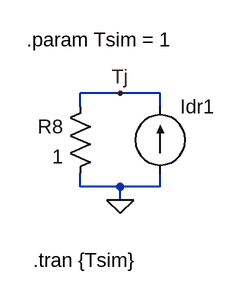
[diagram p0: schematic thermal_test_file.asc]
* thermal_test_file.asc
R8 Tj 0 1
Idr1 0 Tj PWL(0               0        0.000999               0           0.001           20000   0.00100693863           20000   0.00101392541           20000   0.00102096066           20000   0.00102804473           20000   0.00103517796           20000   0.00104236067           20000   0.00104959323           20000   0.00105687597               0   0.00106420924               0    0.0010715934               0   0.00107902879               0   0.00108651577               0   0.00109405471               0   0.00110164595               0   0.00110928986      18029.5526   0.00111698682      18029.5526   0.00112473718      18029.5526   0.00113254132      18029.5526    0.0011403996      18029.5526   0.00114831241      18029.5526   0.00115628013      18029.5526   0.00116430313      18029.5526    0.0011723818               0   0.00118051653               0    0.0011887077               0    0.0011969557               0   0.00120526094               0    0.0012136238               0   0.00122204469               0     0.001230524      16253.2384   0.00123906216      16253.2384   0.00124765955      16253.2384    0.0012563166      16253.2384   0.00126503372      16253.2384   0.00127381132      16253.2384   0.00128264983      16253.2384   0.00129154967      16253.2384   0.00130051125               0   0.00130953502               0    0.0013186214               0   0.00132777083               0   0.00133698374               0   0.00134626058               0   0.00135560179               0   0.00136500781      14651.9309   0.00137447909      14651.9309    0.0013840161      14651.9309   0.00139361927      14651.9309   0.00140328908      14651.9309   0.00141302599      14651.9309   0.00142283046      14651.9309   0.00143270295      14651.9309   0.00144264395               0   0.00145265393               0   0.00146273336               0   0.00147288272               0   0.00148310251               0   0.00149339322               0   0.00150375532               0   0.00151418933      13208.3879   0.00152469573      13208.3879   0.00153527503      13208.3879   0.00154592774      13208.3879   0.00155665436      13208.3879   0.00156745541      13208.3879   0.00157833141      13208.3879   0.00158928287      13208.3879   0.00160031031               0   0.00161141428               0   0.00162259529               0   0.00163385388               0   0.00164519059               0   0.00165660596               0   0.00166810054               0   0.00167967487      11907.0663   0.00169132952      11907.0663   0.00170306503      11907.0663   0.00171488197      11907.0663    0.0017267809      11907.0663    0.0017387624      11907.0663   0.00175082703      11907.0663   0.00176297538      11907.0663   0.00177520801               0   0.00178752553               0   0.00179992851               0   0.00181241755               0   0.00182499324               0    0.0018376562               0   0.00185040702               0   0.00186324631      10733.9539   0.00187617469      10733.9539   0.00188919278      10733.9539   0.00190230119      10733.9539   0.00191550056      10733.9539   0.00192879151      10733.9539   0.00194217468      10733.9539   0.00195565072      10733.9539   0.00196922026               0   0.00198288395               0   0.00199664245               0   0.00201049642               0   0.00202444651               0    0.0020384934               0   0.00205263775               0   0.00206688025      9676.41933   0.00208122157      9676.41933    0.0020956624      9676.41933   0.00211020343      9676.41933   0.00212484535      9676.41933   0.00213958887      9676.41933   0.00215443469      9676.41933   0.00216938352      9676.41933   0.00218443607               0   0.00219959307               0   0.00221485523               0    0.0022302233               0     0.002245698               0   0.00226128007               0   0.00227697026               0   0.00229276931      8723.07558   0.00230867799      8723.07558   0.00232469706      8723.07558   0.00234082728      8723.07558   0.00235706941      8723.07558   0.00237342425      8723.07558   0.00238989257      8723.07558   0.00240647515      8723.07558   0.00242317279               0    0.0024399863               0   0.00245691646               0    0.0024739641               0   0.00249113003               0   0.00250841506               0   0.00252582003               0   0.00254334576      7863.65751    0.0025609931      7863.65751   0.00257876289      7863.65751   0.00259665597      7863.65751   0.00261467321      7863.65751   0.00263281547      7863.65751    0.0026510836      7863.65751   0.00266947849      7863.65751   0.00268800102               0   0.00270665207               0   0.00272543253               0    0.0027443433               0   0.00276338529               0    0.0027825594               0   0.00280186656               0   0.00282130768      7088.91135   0.00284088369      7088.91135   0.00286059554      7088.91135   0.00288044415      7088.91135   0.00290043049      7088.91135   0.00292055551      7088.91135   0.00294082017      7088.91135   0.00296122544      7088.91135   0.00298177229               0   0.00300246171               0   0.00302329468               0   0.00304427221               0    0.0030653953               0   0.00308666494               0   0.00310808217               0   0.00312964801      6390.49501   0.00315136348      6390.49501   0.00317322963      6390.49501   0.00319524751      6390.49501   0.00321741815      6390.49501   0.00323974263      6390.49501   0.00326222201      6390.49501   0.00328485737      6390.49501   0.00330764978               0   0.00333060034               0   0.00335371015               0   0.00337698031               0   0.00340041193               0   0.00342400614               0   0.00344776405               0   0.00347168682      5760.88831   0.00349577557      5760.88831   0.00352003147      5760.88831   0.00354445567      5760.88831   0.00356904935      5760.88831   0.00359381366      5760.88831   0.00361874981      5760.88831   0.00364385898      5760.88831   0.00366914238               0   0.00369460121               0   0.00372023668               0   0.00374605003               0   0.00377204249               0   0.00379821531               0   0.00382456972               0     0.003851107      5193.31195   0.00387782841      5193.31195   0.00390473524      5193.31195   0.00393182876      5193.31195   0.00395911027      5193.31195   0.00398658107      5193.31195   0.00401424249      5193.31195   0.00404209584      5193.31195   0.00407014245               0   0.00409838367               0   0.00412682085               0   0.00415545533               0   0.00418428851               0   0.00421332174               0   0.00424255643               0   0.00427199397      4681.65455   0.00430163576      4681.65455   0.00433148322      4681.65455   0.00436153779      4681.65455   0.00439180089      4681.65455   0.00442227398      4681.65455   0.00445295851      4681.65455   0.00448385595      4681.65455   0.00451496777               0   0.00454629547               0   0.00457784054               0   0.00460960449               0   0.00464158883               0   0.00467379511               0   0.00470622485               0   0.00473887961      4220.40686   0.00477176095      4220.40686   0.00480487044      4220.40686   0.00483820966      4220.40686   0.00487178022      4220.40686   0.00490558371      4220.40686   0.00493962174      4220.40686   0.00497389596      4220.40686   0.00500840799               0   0.00504315949               0   0.00507815211               0   0.00511338754               0   0.00514886745               0   0.00518459354               0   0.00522056753               0   0.00525679112      3804.60238   0.00529326606      3804.60238   0.00532999408      3804.60238   0.00536697695      3804.60238   0.00540421642      3804.60238   0.00544171429      3804.60238   0.00547947234      3804.60238   0.00551749238      3804.60238   0.00555577622               0   0.00559432571               0   0.00563314267               0   0.00567222897               0   0.00571158648               0   0.00575121707               0   0.00579112265               0   0.00583130511      3429.76394   0.00587176639      3429.76394   0.00591250841      3429.76394   0.00595353313      3429.76394    0.0059948425      3429.76394   0.00603643851      3429.76394   0.00607832313      3429.76394   0.00612049837      3429.76394   0.00616296626               0   0.00620572881               0   0.00624878807               0   0.00629214611               0   0.00633580499               0   0.00637976681               0   0.00642403366               0   0.00646860766      3091.85547   0.00651349095      3091.85547   0.00655868566      3091.85547   0.00660419396      3091.85547   0.00665001803      3091.85547   0.00669616005      3091.85547   0.00674262224      3091.85547   0.00678940681      3091.85547     0.006836516               0   0.00688395207               0   0.00693171728               0   0.00697981391               0   0.00702824426               0   0.00707701066               0   0.00712611543               0   0.00717556092      2787.23855   0.00722534949      2787.23855   0.00727548353      2787.23855   0.00732596543      2787.23855    0.0073767976      2787.23855   0.00742798248      2787.23855   0.00747952252      2787.23855   0.00753142017      2787.23855   0.00758367791               0   0.00763629826               0   0.00768928372               0   0.00774263683               0   0.00779636013               0    0.0078504562               0   0.00790492762               0     0.007959777       2512.6332   0.00801500696       2512.6332   0.00807062014       2512.6332    0.0081266192       2512.6332   0.00818300682       2512.6332   0.00823978568       2512.6332   0.00829695852       2512.6332   0.00835452806       2512.6332   0.00841249705               0   0.00847086827               0    0.0085296445               0   0.00858882856               0   0.00864842328               0    0.0087084315               0   0.00876885609               0   0.00882969996      2265.08263   0.00889096599      2265.08263   0.00895265713      2265.08263   0.00901477631      2265.08263   0.00907732653      2265.08263   0.00914031075      2265.08263     0.009203732      2265.08263    0.0092675933      2265.08263   0.00933189772               0   0.00939664831               0   0.00946184819               0   0.00952750047               0   0.00959360829               0    0.0096601748               0   0.00972720319               0   0.00979469667      2041.92132   0.00986265846      2041.92132   0.00993109181      2041.92132            0.01      2041.92132    0.0100693863      2041.92132    0.0101392541      2041.92132    0.0102096066      2041.92132    0.0102804473      2041.92132    0.0103517796               0    0.0104236067               0    0.0104959323               0    0.0105687597               0    0.0106420924               0     0.010715934               0    0.0107902879               0    0.0108651577       1840.7464    0.0109405471       1840.7464    0.0110164595       1840.7464    0.0110928986       1840.7464    0.0111698682       1840.7464    0.0112473718       1840.7464    0.0113254132       1840.7464     0.011403996       1840.7464    0.0114831241               0    0.0115628013               0    0.0116430313               0     0.011723818               0    0.0118051653               0     0.011887077               0     0.011969557               0    0.0120526094       1659.3917     0.012136238       1659.3917    0.0122204469       1659.3917      0.01230524       1659.3917    0.0123906216       1659.3917    0.0124765955       1659.3917     0.012563166       1659.3917    0.0126503372       1659.3917    0.0127381132               0    0.0128264983               0    0.0129154967               0    0.0130051125               0    0.0130953502               0     0.013186214               0    0.0132777083               0    0.0133698374       1495.9045    0.0134626058       1495.9045    0.0135560179       1495.9045    0.0136500781       1495.9045    0.0137447909       1495.9045     0.013840161       1495.9045    0.0139361927       1495.9045    0.0140328908       1495.9045    0.0141302599               0    0.0142283046               0    0.0143270295               0    0.0144264395               0    0.0145265393               0    0.0146273336               0    0.0147288272               0    0.0148310251      1348.52445    0.0149339322      1348.52445    0.0150375532      1348.52445    0.0151418933      1348.52445    0.0152469573      1348.52445    0.0153527503      1348.52445    0.0154592774      1348.52445    0.0155665436      1348.52445    0.0156745541               0    0.0157833141               0    0.0158928287               0    0.0160031031               0    0.0161141428               0    0.0162259529               0    0.0163385388               0    0.0164519059      1215.66463    0.0165660596      1215.66463    0.0166810054      1215.66463    0.0167967487      1215.66463    0.0169132952      1215.66463    0.0170306503      1215.66463    0.0171488197      1215.66463     0.017267809      1215.66463     0.017387624               0    0.0175082703               0    0.0176297538               0    0.0177520801               0    0.0178752553               0    0.0179992851               0    0.0181241755               0    0.0182499324      1095.89447     0.018376562      1095.89447    0.0185040702      1095.89447    0.0186324631      1095.89447    0.0187617469      1095.89447    0.0188919278      1095.89447    0.0190230119      1095.89447    0.0191550056      1095.89447    0.0192879151               0    0.0194217468               0    0.0195565072               0    0.0196922026               0    0.0198288395               0    0.0199664245               0    0.0201049642               0    0.0202444651      987.924349     0.020384934      987.924349    0.0205263775      987.924349    0.0206688025      987.924349    0.0208122157      987.924349     0.020956624      987.924349    0.0211020343      987.924349    0.0212484535      987.924349    0.0213958887               0    0.0215443469               0    0.0216938352               0    0.0218443607               0    0.0219959307               0    0.0221485523               0     0.022302233               0      0.02245698      890.591702    0.0226128007      890.591702    0.0227697026      890.591702    0.0229276931      890.591702    0.0230867799      890.591702    0.0232469706      890.591702    0.0234082728      890.591702    0.0235706941      890.591702    0.0237342425               0    0.0238989257               0    0.0240647515               0    0.0242317279               0     0.024399863               0    0.0245691646               0     0.024739641               0    0.0249113003      802.848498    0.0250841506      802.848498    0.0252582003      802.848498    0.0254334576      802.848498     0.025609931      802.848498    0.0257876289      802.848498    0.0259665597      802.848498    0.0261467321      802.848498    0.0263281547               0     0.026510836               0    0.0266947849               0    0.0268800102               0    0.0270665207               0    0.0272543253               0     0.027443433               0    0.0276338529      723.749962     0.027825594      723.749962    0.0280186656      723.749962    0.0282130768      723.749962    0.0284088369      723.749962    0.0286059554      723.749962    0.0288044415      723.749962    0.0290043049      723.749962    0.0292055551               0    0.0294082017               0    0.0296122544               0    0.0298177229               0    0.0300246171               0    0.0302329468               0    0.0304427221               0     0.030653953      652.444402    0.0308666494      652.444402    0.0310808217      652.444402    0.0312964801      652.444402    0.0315136348      652.444402    0.0317322963      652.444402    0.0319524751      652.444402    0.0321741815      652.444402    0.0323974263               0    0.0326222201               0    0.0328485737               0    0.0330764978               0    0.0333060034               0    0.0335371015               0    0.0337698031               0    0.0340041193      588.164034    0.0342400614      588.164034    0.0344776405      588.164034    0.0347168682      588.164034    0.0349577557      588.164034    0.0352003147      588.164034    0.0354445567      588.164034    0.0356904935      588.164034    0.0359381366               0    0.0361874981               0    0.0364385898               0    0.0366914238               0    0.0369460121               0    0.0372023668               0    0.0374605003               0    0.0377204249       530.21672    0.0379821531       530.21672    0.0382456972       530.21672      0.03851107       530.21672    0.0387782841       530.21672    0.0390473524       530.21672    0.0393182876       530.21672    0.0395911027       530.21672    0.0398658107               0    0.0401424249               0    0.0404209584               0    0.0407014245               0    0.0409838367               0    0.0412682085               0    0.0415545533               0    0.0418428851      477.978513    0.0421332174      477.978513    0.0424255643      477.978513    0.0427199397      477.978513    0.0430163576      477.978513    0.0433148322      477.978513    0.0436153779      477.978513    0.0439180089      477.978513    0.0442227398               0    0.0445295851               0    0.0448385595               0    0.0451496777               0    0.0454629547               0    0.0457784054               0    0.0460960449               0    0.0464158883      430.886938    0.0467379511      430.886938    0.0470622485      430.886938    0.0473887961      430.886938    0.0477176095      430.886938    0.0480487044      430.886938    0.0483820966      430.886938    0.0487178022      430.886938    0.0490558371               0    0.0493962174               0    0.0497389596               0    0.0500840799               0    0.0504315949               0    0.0507815211               0    0.0511338754               0    0.0514886745      388.434936    0.0518459354      388.434936    0.0522056753      388.434936    0.0525679112      388.434936    0.0529326606      388.434936    0.0532999408      388.434936    0.0536697695      388.434936    0.0540421642      388.434936    0.0544171429               0    0.0547947234               0    0.0551749238               0    0.0555577622               0    0.0559432571               0    0.0563314267               0    0.0567222897               0    0.0571158648      350.165406    0.0575121707      350.165406    0.0579112265      350.165406    0.0583130511      350.165406    0.0587176639      350.165406    0.0591250841      350.165406    0.0595353313      350.165406     0.059948425      350.165406    0.0603643851               0    0.0607832313               0    0.0612049837               0    0.0616296626               0    0.0620572881               0    0.0624878807               0    0.0629214611               0    0.0633580499      315.666281    0.0637976681      315.666281    0.0642403366      315.666281    0.0646860766      315.666281    0.0651349095      315.666281    0.0655868566      315.666281    0.0660419396      315.666281    0.0665001803      315.666281    0.0669616005               0    0.0674262224               0    0.0678940681               0      0.06836516               0    0.0688395207               0    0.0693171728               0    0.0697981391               0    0.0702824426      284.566091    0.0707701066      284.566091    0.0712611543      284.566091    0.0717556092      284.566091    0.0722534949      284.566091    0.0727548353      284.566091    0.0732596543      284.566091     0.073767976      284.566091    0.0742798248               0    0.0747952252               0    0.0753142017               0    0.0758367791               0    0.0763629826               0    0.0768928372               0    0.0774263683               0    0.0779636013      256.529966     0.078504562      256.529966    0.0790492762      256.529966      0.07959777      256.529966    0.0801500696      256.529966    0.0807062014      256.529966     0.081266192      256.529966    0.0818300682      256.529966    0.0823978568               0    0.0829695852               0    0.0835452806               0    0.0841249705               0    0.0847086827               0     0.085296445               0    0.0858882856               0    0.0864842328      231.256026     0.087084315      231.256026    0.0876885609      231.256026    0.0882969996      231.256026    0.0889096599      231.256026    0.0895265713      231.256026    0.0901477631      231.256026    0.0907732653      231.256026    0.0914031075               0      0.09203732               0     0.092675933               0    0.0933189772               0    0.0939664831               0    0.0946184819               0    0.0952750047               0    0.0959360829      208.472135     0.096601748      208.472135    0.0972720319      208.472135    0.0979469667      208.472135    0.0986265846      208.472135    0.0993109181      208.472135             0.1      208.472135     0.100693863      208.472135     0.101392541               0     0.102096066               0     0.102804473               0     0.103517796               0     0.104236067               0     0.104959323               0     0.105687597               0     0.106420924      187.932966      0.10715934      187.932966     0.107902879      187.932966     0.108651577      187.932966     0.109405471      187.932966     0.110164595      187.932966     0.110928986      187.932966     0.111698682      187.932966     0.112473718               0     0.113254132               0      0.11403996               0     0.114831241               0     0.115628013               0     0.116430313               0      0.11723818               0     0.118051653      169.417365      0.11887077      169.417365      0.11969557      169.417365     0.120526094      169.417365      0.12136238      169.417365     0.122204469      169.417365       0.1230524      169.417365     0.123906216      169.417365     0.124765955               0      0.12563166               0     0.126503372               0     0.127381132               0     0.128264983               0     0.129154967               0     0.130051125               0     0.130953502      152.725965      0.13186214      152.725965     0.132777083      152.725965     0.133698374      152.725965     0.134626058      152.725965     0.135560179      152.725965     0.136500781      152.725965     0.137447909      152.725965      0.13840161               0     0.139361927               0     0.140328908               0     0.141302599               0     0.142283046               0     0.143270295               0     0.144264395               0     0.145265393      137.679041     0.146273336      137.679041     0.147288272      137.679041     0.148310251      137.679041     0.149339322      137.679041     0.150375532      137.679041     0.151418933      137.679041     0.152469573      137.679041     0.153527503               0     0.154592774               0     0.155665436               0     0.156745541               0     0.157833141               0     0.158928287               0     0.160031031               0     0.161141428      124.114576     0.162259529      124.114576     0.163385388      124.114576     0.164519059      124.114576     0.165660596      124.114576     0.166810054      124.114576     0.167967487      124.114576     0.169132952      124.114576     0.170306503               0     0.171488197               0      0.17267809               0      0.17387624               0     0.175082703               0     0.176297538               0     0.177520801               0     0.178752553      111.886514     0.179992851      111.886514     0.181241755      111.886514     0.182499324      111.886514      0.18376562      111.886514     0.185040702      111.886514     0.186324631      111.886514     0.187617469      111.886514     0.188919278               0     0.190230119               0     0.191550056               0     0.192879151               0     0.194217468               0     0.195565072               0     0.196922026               0     0.198288395       100.86319     0.199664245       100.86319     0.201049642       100.86319     0.202444651       100.86319      0.20384934       100.86319     0.205263775       100.86319     0.206688025       100.86319     0.208122157       100.86319      0.20956624               0     0.211020343               0     0.212484535               0     0.213958887               0     0.215443469               0     0.216938352               0     0.218443607               0     0.219959307      90.9259094     0.221485523      90.9259094      0.22302233      90.9259094       0.2245698      90.9259094     0.226128007      90.9259094     0.227697026      90.9259094     0.229276931      90.9259094     0.230867799      90.9259094     0.232469706               0     0.234082728               0     0.235706941               0     0.237342425               0     0.238989257               0     0.240647515               0     0.242317279               0      0.24399863      81.9676734     0.245691646      81.9676734      0.24739641      81.9676734     0.249113003      81.9676734     0.250841506      81.9676734     0.252582003      81.9676734     0.254334576      81.9676734      0.25609931      81.9676734     0.257876289               0     0.259665597               0     0.261467321               0     0.263281547               0      0.26510836               0     0.266947849               0     0.268800102               0     0.270665207      73.8920241     0.272543253      73.8920241      0.27443433      73.8920241     0.276338529      73.8920241      0.27825594      73.8920241     0.280186656      73.8920241     0.282130768      73.8920241     0.284088369      73.8920241     0.286059554               0     0.288044415               0     0.290043049               0     0.292055551               0     0.294082017               0     0.296122544               0     0.298177229               0     0.300246171      66.6120069     0.302329468      66.6120069     0.304427221      66.6120069      0.30653953      66.6120069     0.308666494      66.6120069     0.310808217      66.6120069     0.312964801      66.6120069     0.315136348      66.6120069     0.317322963               0     0.319524751               0     0.321741815               0     0.323974263               0     0.326222201               0     0.328485737               0     0.330764978               0     0.333060034      60.0492342     0.335371015      60.0492342     0.337698031      60.0492342     0.340041193      60.0492342     0.342400614      60.0492342     0.344776405      60.0492342     0.347168682      60.0492342     0.349577557      60.0492342     0.352003147               0     0.354445567               0     0.356904935               0     0.359381366               0     0.361874981               0     0.364385898               0     0.366914238               0     0.369460121      54.1330414     0.372023668      54.1330414     0.374605003      54.1330414     0.377204249      54.1330414     0.379821531      54.1330414     0.382456972      54.1330414       0.3851107      54.1330414     0.387782841      54.1330414     0.390473524               0     0.393182876               0     0.395911027               0     0.398658107               0     0.401424249               0     0.404209584               0     0.407014245               0     0.409838367      48.7997259     0.412682085      48.7997259     0.415545533      48.7997259     0.418428851      48.7997259     0.421332174      48.7997259     0.424255643      48.7997259     0.427199397      48.7997259     0.430163576      48.7997259     0.433148322               0     0.436153779               0     0.439180089               0     0.442227398               0     0.445295851               0     0.448385595               0     0.451496777               0     0.454629547      43.9918614     0.457784054      43.9918614     0.460960449      43.9918614     0.464158883      43.9918614     0.467379511      43.9918614     0.470622485      43.9918614     0.473887961      43.9918614     0.477176095      43.9918614     0.480487044               0     0.483820966               0     0.487178022               0     0.490558371               0     0.493962174               0     0.497389596               0     0.500840799               0     0.504315949       39.657679     0.507815211       39.657679     0.511338754       39.657679     0.514886745       39.657679     0.518459354       39.657679     0.522056753       39.657679     0.525679112       39.657679     0.529326606       39.657679     0.532999408               0     0.536697695               0     0.540421642               0     0.544171429               0     0.547947234               0     0.551749238               0     0.555577622               0     0.559432571      35.7505105     0.563314267      35.7505105     0.567222897      35.7505105     0.571158648      35.7505105     0.575121707      35.7505105     0.579112265      35.7505105     0.583130511      35.7505105     0.587176639      35.7505105     0.591250841               0     0.595353313               0      0.59948425               0     0.603643851               0     0.607832313               0     0.612049837               0     0.616296626               0     0.620572881      32.2282855     0.624878807      32.2282855     0.629214611      32.2282855     0.633580499      32.2282855     0.637976681      32.2282855     0.642403366      32.2282855     0.646860766      32.2282855     0.651349095      32.2282855     0.655868566               0     0.660419396               0     0.665001803               0     0.669616005               0     0.674262224               0     0.678940681               0       0.6836516               0     0.688395207      29.0530785     0.693171728      29.0530785     0.697981391      29.0530785     0.702824426      29.0530785     0.707701066      29.0530785     0.712611543      29.0530785     0.717556092      29.0530785     0.722534949      29.0530785     0.727548353               0     0.732596543               0      0.73767976               0     0.742798248               0     0.747952252               0     0.753142017               0     0.758367791               0     0.763629826      26.1907004     0.768928372      26.1907004     0.774263683      26.1907004     0.779636013      26.1907004      0.78504562      26.1907004     0.790492762      26.1907004       0.7959777      26.1907004     0.801500696      26.1907004     0.807062014               0      0.81266192               0     0.818300682               0     0.823978568               0     0.829695852               0     0.835452806               0     0.841249705               0     0.847086827      23.6103306      0.85296445      23.6103306     0.858882856      23.6103306     0.864842328      23.6103306      0.87084315      23.6103306     0.876885609      23.6103306     0.882969996      23.6103306     0.889096599      23.6103306     0.895265713               0     0.901477631               0     0.907732653               0     0.914031075               0       0.9203732               0      0.92675933               0     0.933189772               0     0.939664831      21.2841849     0.946184819      21.2841849     0.952750047      21.2841849     0.959360829      21.2841849      0.96601748      21.2841849     0.972720319      21.2841849     0.979469667      21.2841849     0.986265846      21.2841849     0.993109181               0               1               0)
.param Tsim = 1
.tran {Tsim}
.backanno
.end